# Altium project Rev_03_ET_Toolkit_Simple_Version.PrjPcb
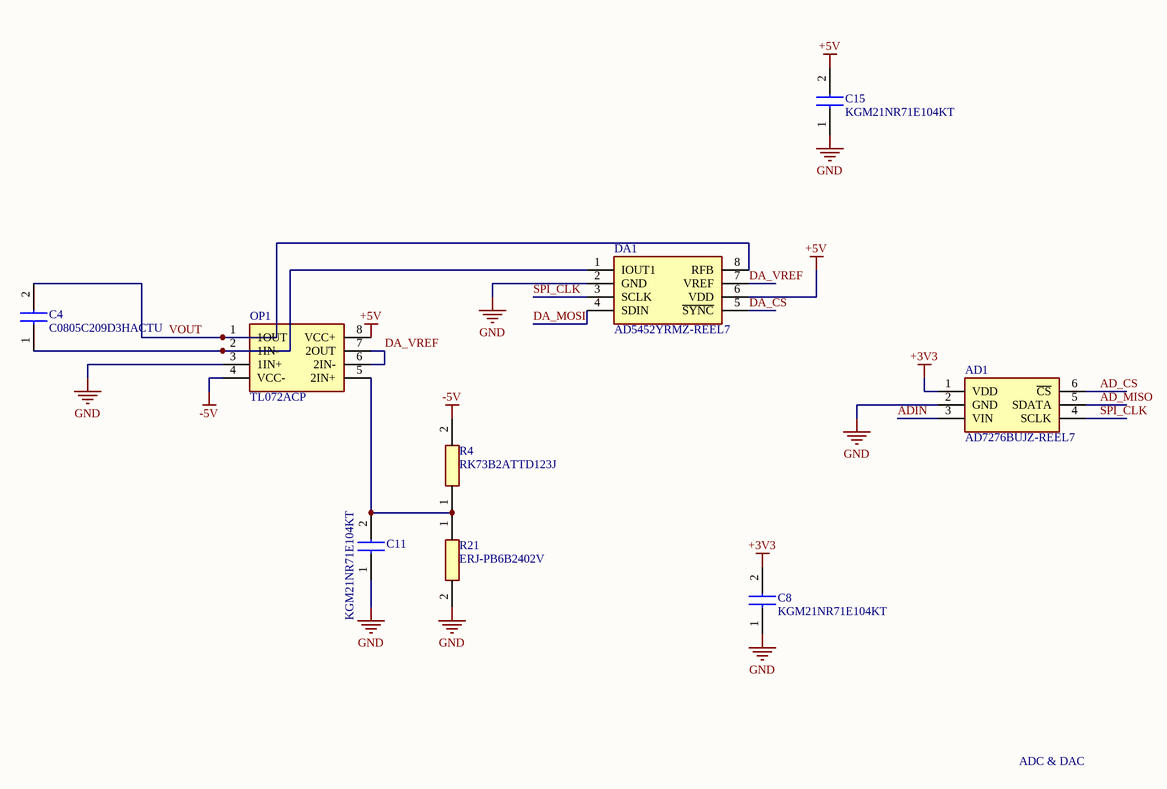
[diagram p0: Sheet1.SchDoc]
1 sheet, 9 parts. Net scope: global (net labels, ports and power ports of the same name join across sheets).
Board files: REV_02_Simple_PCB.PcbDoc, REV_03_Simple_PCB.PcbDoc, REV_01_Simple_PCB.PcbDoc, PCB1.PcbDoc

## Sheet Sheet1.SchDoc
size A4; SheetNumber: 1; SheetTotal: 5

### Parts
AD1  AD7276BUJZ-REEL7  [SOT95P280X100-6N]
C4  C0805C209D3HACTU  [C0805]
C8  KGM21NR71E104KT  [CAPC2012X100N]
C11  KGM21NR71E104KT  [CAPC2012X100N]
C15  KGM21NR71E104KT  [CAPC2012X100N]
DA1  AD5452YRMZ-REEL7  [SOP65P490X110-8N]
OP1  TL072ACP  [DIP794W53P254L959H508Q8N]
R4  RK73B2ATTD123J  [RESC2012X60N]
R21  ERJ-PB6B2402V  [RESC2012X70N]

### Nets
+3V3: AD1.1(VDD) C8.2
+5V: C15.2 DA1.6(VDD) OP1.8(VCC+)
-5V: OP1.4(VCC-) R4.2
GND: AD1.2(GND) C8.1 C11.1 C15.1 DA1.2(GND) OP1.3(1IN+) R21.2
AD_CS: AD1.6(~{CS})
AD_MISO: AD1.5(SDATA)
ADIN: AD1.3(VIN)
DA_CS: DA1.5(~{SYNC})
DA_MOSI: DA1.4(SDIN)
DA_VREF: DA1.7(VREF) OP1.6(2IN-) OP1.7(2OUT)
SPI_CLK: AD1.4(SCLK) DA1.3(SCLK)
VOUT: C4.2 DA1.8(RFB) OP1.1(1OUT)
NetC4_1: C4.1 DA1.1(IOUT1) OP1.2(1IN-)
NetC11_2: C11.2 OP1.5(2IN+) R4.1 R21.1

### Notes on the sheet
- ADC & DAC

### Library data of the parts
AD1 = AD7276BUJZ-REEL7: Integrated Circuit; Manufacturer_Name: Analog Devices; Datasheet Link: https://www.arrow.com/en/products/ad7276bujz-reel7/analog-devices; Height: 1mm; Manufacturer_Part_Number: AD7276BUJZ-REEL7; Arrow Part Number: AD7276BUJZ-REEL7; Arrow Price/Stock: https://www.arrow.com/en/products/ad7276bujz-reel7/analog-devices
C4 = C0805C209D3HACTU: Capacitor; Manufacturer_Name: KEMET; Datasheet Link: https://content.kemet.com/datasheets/KEM_C1007_X8R_ULTRA_150C_SMD.pdf; Height: 1.1mm; Manufacturer_Part_Number: C0805C209D3HACTU
C8 C11 C15 = KGM21NR71E104KT: Capacitor; Manufacturer_Name: KYOCERA; Datasheet Link: https://spicat.kyocera-avx.com/product/mlcc/chartview/KGM21NR71E104KT/DataSheet/X7R; Height: 1mm; Manufacturer_Part_Number: KGM21NR71E104KT; Mouser Part Number: 581-KGM21NR71E104KT; Mouser Price/Stock: https://www.mouser.co.uk/ProductDetail/KYOCERA-AVX/KGM21NR71E104KT?qs=OcgtsXO%252B3gt5l3KgnBGsBw%3D%3D
DA1 = AD5452YRMZ-REEL7: Integrated Circuit; Manufacturer_Name: Analog Devices; Datasheet Link: https://componentsearchengine.com/Datasheets/1/AD5452YRMZ-REEL7.pdf; Height: 1.1mm; Manufacturer_Part_Number: AD5452YRMZ-REEL7; Mouser Part Number: 584-AD5452YRMZ-R7; Mouser Price/Stock: https://www.mouser.com/Search/Refine.aspx?Keyword=584-AD5452YRMZ-R7; Arrow Part Number: AD5452YRMZ-REEL7; Arrow Price/Stock: https://www.arrow.com/en/products/ad5452yrmz-reel7/analog-devices
OP1 = TL072ACP: Integrated Circuit; Manufacturer_Name: Texas Instruments; Datasheet Link: http://www.ti.com/lit/ds/symlink/tl071a.pdf; Height: 5.08mm; Manufacturer_Part_Number: TL072ACP; Mouser Part Number: 595-TL072ACP; Mouser Price/Stock: https://www.mouser.co.uk/ProductDetail/Texas-Instruments/TL072ACP?qs=0OT4q4QBUTLFvIZ%252B%2FvrwoQ%3D%3D; Arrow Part Number: TL072ACP; Arrow Price/Stock: https://www.arrow.com/en/products/tl072acp/texas-instruments?region=nac
R4 = RK73B2ATTD123J: Resistor; Manufacturer_Name: KOA Speer; Datasheet Link: https://www.mouser.jp/datasheet/2/219/RK73B-1825463.pdf; Height: 0.6mm; Manufacturer_Part_Number: RK73B2ATTD123J
R21 = ERJ-PB6B2402V: Resistor; Manufacturer_Name: Panasonic; Datasheet Link: https://componentsearchengine.com/Datasheets/1/ERJ-PB6B2402V.pdf; Height: 0.7mm; Manufacturer_Part_Number: ERJ-PB6B2402V; Mouser Part Number: 667-ERJ-PB6B2402V; Mouser Price/Stock: https://www.mouser.com/Search/Refine.aspx?Keyword=667-ERJ-PB6B2402V